# EAGLE design IR-Blue BT2 PCB (EAGLE 6.2)
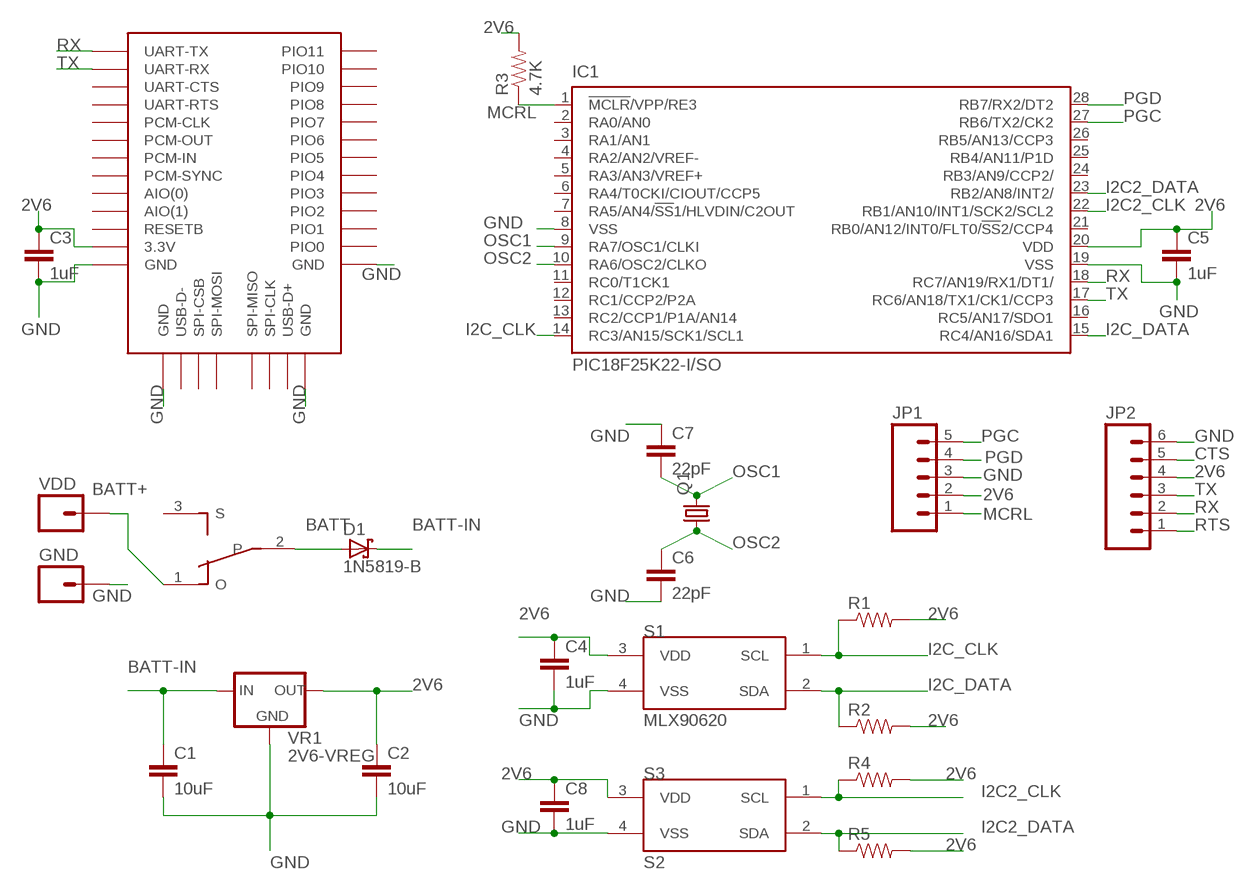
[diagram p0: schematic, sheet 1]

## Parts
C1  10uF  CAPPTH1  [CAP-PTH-5MM]
C2  10uF  CAPPTH1  [CAP-PTH-5MM]
C3  1uF  CAPPTH1  [CAP-PTH-5MM]
C4  1uF  CAPPTH1  [CAP-PTH-5MM]
C5  1uF  CAPPTH1  [CAP-PTH-5MM]
C6  22pF  CAPPTH1  [CAP-PTH-5MM]
C7  22pF  CAPPTH1  [CAP-PTH-5MM]
C8  1uF  CAPPTH1  [CAP-PTH-5MM]
D1  1N5819-B  [DO41-7.6]
GND  M01PTH  [1X01]
IC1  PIC18F25K22-I/SO  [SO28W]
JP1  M05PTH  [1X05]
JP2  M06SIP  [1X06]
Q1  CRYSTALHC49S  [HC49/S]
R1  RESISTORPTH-1/4W  [AXIAL-0.4]
R2  RESISTORPTH-1/4W  [AXIAL-0.4]
R3  4.7K  RESISTORPTH-1/4W  [AXIAL-0.4]
R4  RESISTORPTH-1/4W  [AXIAL-0.4]
R5  RESISTORPTH-1/4W  [AXIAL-0.4]
S1  MLX90620  [TO-39]
S3  S2  MLX90620  [TO-39]
SW1  SMALL_SWITCH  [EG1213]
U$3  BTM400_6B  [BTM400_6B]
VDD  M01PTH  [1X01]
VR1  2V6-VREG  [TO-92]

## Nets
2V6: C2.1 C3.1 C4.1 C5.1 C8.1 IC1.20(VDD) JP1.2 JP2.4 R1.P$2 R2.P$2 R3.P$2 R4.P$2 R5.P$2 S1.3(VDD) S3.3(VDD) U$3.3.3V VR1.1(OUT)
BATT: D1.A SW1.2(P)
BATT+: SW1.1(O) VDD.1
BATT-IN: C1.1 D1.C VR1.3(IN)
CTS: JP2.5
GND [Small 8mil]: C1.2 C2.2 C3.2 C4.2 C5.2 C6.2 C7.1 C8.2 GND.1 IC1.8(VSS) IC1.19(VSS) JP1.3 JP2.6 S1.4(VSS) S3.4(VSS) U$3.GND@1(GND) U$3.GND@2(GND) U$3.GND@3(GND) U$3.GND@4(GND) VR1.2(GND)
I2C2_CLK: IC1.22(RB1/AN10/INT1/SCK2/SCL2) R4.P$1 S3.1(SCL)
I2C2_DATA: IC1.23(RB2/AN8/INT2/) R5.P$1 S3.2(SDA)
I2C_CLK [Small 8mil]: IC1.14(RC3/AN15/SCK1/SCL1) R1.P$1 S1.1(SCL)
I2C_DATA: IC1.15(RC4/AN16/SDA1) R2.P$1 S1.2(SDA)
MCRL: IC1.1(!MCLR!/VPP/RE3) JP1.1 R3.P$1
OSC1 [Medium 10mil]: C7.2 IC1.9(RA7/OSC1/CLKI) Q1.2
OSC2 [Medium 10mil]: C6.1 IC1.10(RA6/OSC2/CLKO) Q1.1
PGC: IC1.27(RB6/TX2/CK2) JP1.5
PGD: IC1.28(RB7/RX2/DT2) JP1.4
RTS: JP2.1
RX: IC1.18(RC7/AN19/RX1/DT1/) JP2.2 U$3.UART-TX
TX: IC1.17(RC6/AN18/TX1/CK1/CCP3) JP2.3 U$3.UART-RX
Unconnected: IC1.2(RA0/AN0) IC1.3(RA1/AN1) IC1.4(RA2/AN2/VREF-) IC1.5(RA3/AN3/VREF+) IC1.6(RA4/T0CKI/CIOUT/CCP5) IC1.7(RA5/AN4/!SS!1/HLVDIN/C2OUT) IC1.11(RC0/T1CK1) IC1.12(RC1/CCP2/P2A) IC1.13(RC2/CCP1/P1A/AN14) IC1.16(RC5/AN17/SDO1) IC1.21(RB0/AN12/INT0/FLT0/!SS!2/CCP4) IC1.24(RB3/AN9/CCP2/) IC1.25(RB4/AN11/P1D) IC1.26(RB5/AN13/CCP3) SW1.3(S) U$3.AIO(0) U$3.AIO(1) U$3.PCM-CLK U$3.PCM-IN U$3.PCM-OUT U$3.PCM-SYNC U$3.PIO(0)(PIO0) U$3.PIO(1)(PIO1) U$3.PIO(2)(PIO2) U$3.PIO(3)(PIO3) U$3.PIO(4)(PIO4) U$3.PIO(5)(PIO5) U$3.PIO(6)(PIO6) U$3.PIO(7)(PIO7) U$3.PIO(8)(PIO8) U$3.PIO(9)(PIO9) U$3.PIO(10)(PIO10) U$3.PIO(11)(PIO11) U$3.RESETB U$3.SPI-CLK U$3.SPI-CSB U$3.SPI-MISO U$3.SPI-MOSI U$3.UART-CTS U$3.UART-RTS U$3.USB-D+ U$3.USB-D-

## Library data of the parts
C1-C8 = SparkFun-Boards:CAP: Capacitor Standard 0603 ceramic capacitor, and 0.1" leaded capacitor.
D1 = diode:1N581*: 1.0A SCHOTTKY BARRIER RECTIFIER Source: http://www.diodes.com/datasheets/ds23001.pdf
GND VDD = SparkFun-Connectors:M01: Header 1 Standard 1-pin 0.1" header. Use with straight break away headers (SKU : PRT-00116), right angle break away headers (PRT-00553), swiss pins (PRT-00743), machine pins (PRT-00117), and female headers (PRT-00115).
IC1 = pic18f25k22:PIC18F25K22: PIC18F25K22 28 pin DIP
JP1 = SparkFun-Connectors:M05: Header 5 Standard 5-pin 0.1" header. Use with straight break away headers (SKU : PRT-00116), right angle break away headers (PRT-00553), swiss pins (PRT-00743), machine pins (PRT-00117), and female headers (PRT-00115). Molex polarized connector foot print use with SKU : PRT-08230 with associated crimp pins and housings.
JP2 = SparkFun-Connectors:M06: Header 6 Standard 6-pin 0.1" header. Use with straight break away headers (SKU : PRT-00116), right angle break away headers (PRT-00553), swiss pins (PRT-00743), machine pins (PRT-00117), and female headers (PRT-00115). Molex polarized connector foot print use with SKU : PRT-08094 with associated crimp pins and housings. NOTES ON THE VARIANTS LOCK and LOCK_LONGPADS... This footprint was designed to help hold the alignment of a through-hole component (i.e. 6-pin header) while soldering it into place. You may notice that each hole has been shifted either up or down by 0.005 of an inch from it's more standard position (which is a perfectly straight line). This slight alteration caused the pins (the squares in the middle) to touch the edges of the holes. Because they are alternating, it causes a "brace" to hold the component in place. 0.005 has proven to be the perfect amount of "off-center" position when using our standard breakaway headers. Although looks a little odd when you look at the bare footprint, once you have a header in there, the alteration is very hard to notice. Also, if you push a header all the way into place, it is covered up entirely on the bottom side. This idea of altering the position of holes to aid alignment will be further integrated into the Sparkfun Library for other footprints. It can help hold any component with 3 or more connection pins.
Q1 = crystal:CRYSTAL: CRYSTAL; OC_FARNELL: 1667008; OC_NEWARK: unknown
R1-R5 = SparkFun-LED:RESISTOR: Resistor Basic schematic elements and footprints for 0603, 1206, and PTH resistors.
S1 S3 = RHWorkshop:MLX90620: The MLX90620 is a fully calibrated 16x4 pixels IR array in an industry standard 4-lead TO-39 package. It contains 2 chips in one package: the Mlx90670 (IR array with signal conditioning electronics) and the 24AA02 (256x8 EEPROM) chip. The MlX90620 contains 64 IR pixels with dedicated low noise chopper stabilized amplifier and fast ADC integrated. A PTAT (Proportional To Absolute Temperature) sensor is integrated to measure the ambient temperature of the chip. The outputs of both IR and PTAT sensors are stored in internal RAM and are accessible through I2C.
SW1 = RHWorkshop:SMALL_SWITCH
U$3 = misc:BTM400_6B
VR1 = RHWorkshop:2V6-VREG

## Net classes
0 default: width 0.406 mm, drill 0.305 mm, clearance 0.305 mm
1 Small 8mil: width 0.203 mm, drill 0.254 mm, clearance 0.203 mm
2 Medium 10mil: width 0.254 mm, drill 0.254 mm, clearance 0.254 mm
3 Large 12mil: width 0.305 mm, drill 0.254 mm, clearance 0.305 mm

## Board
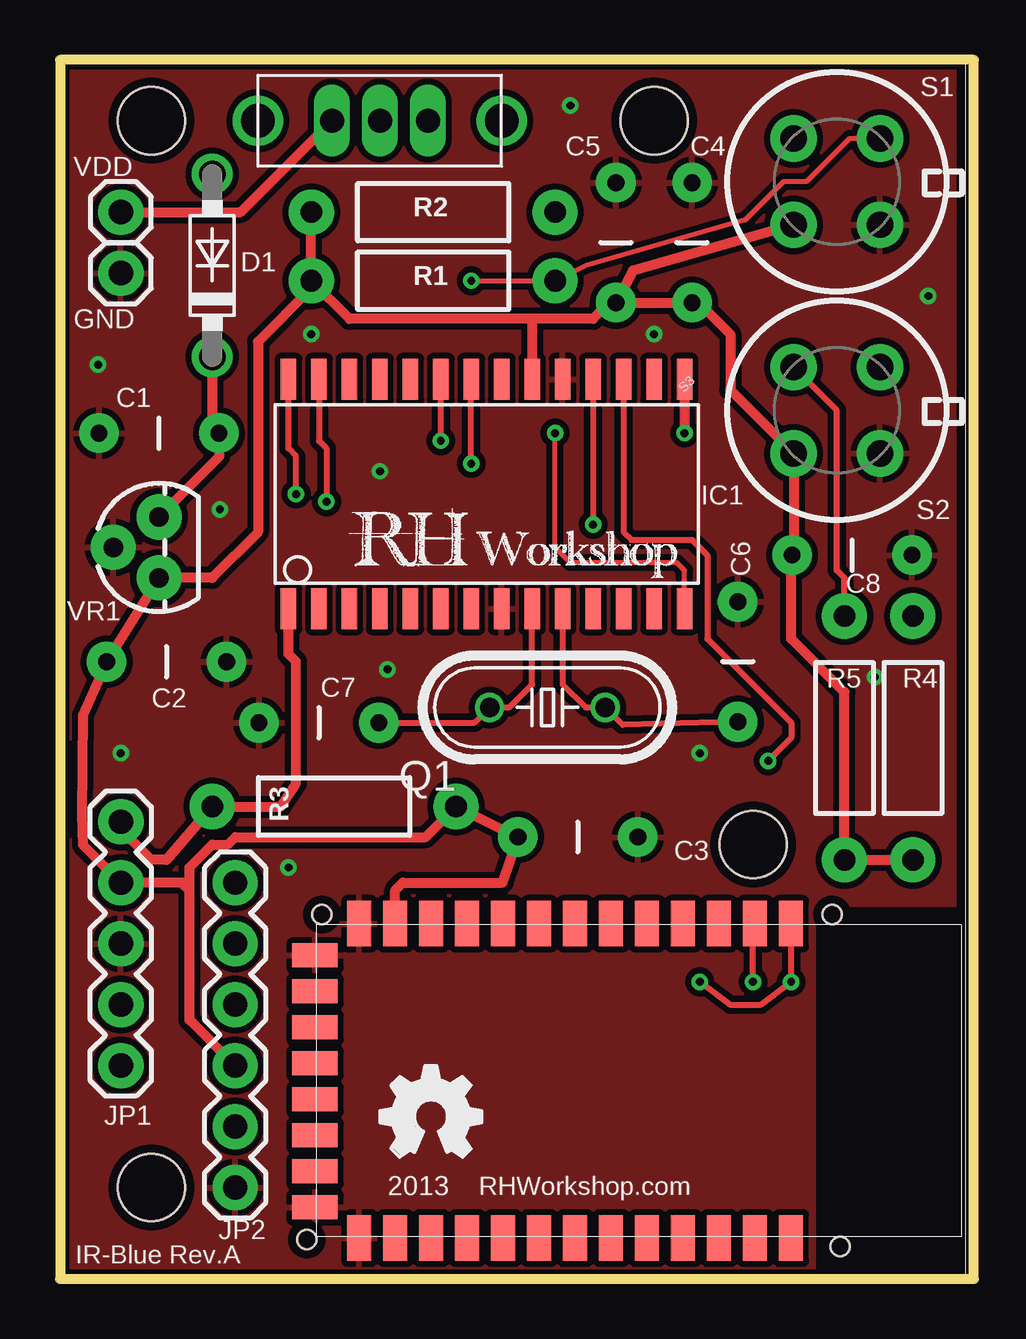
[diagram p1: board, top side]
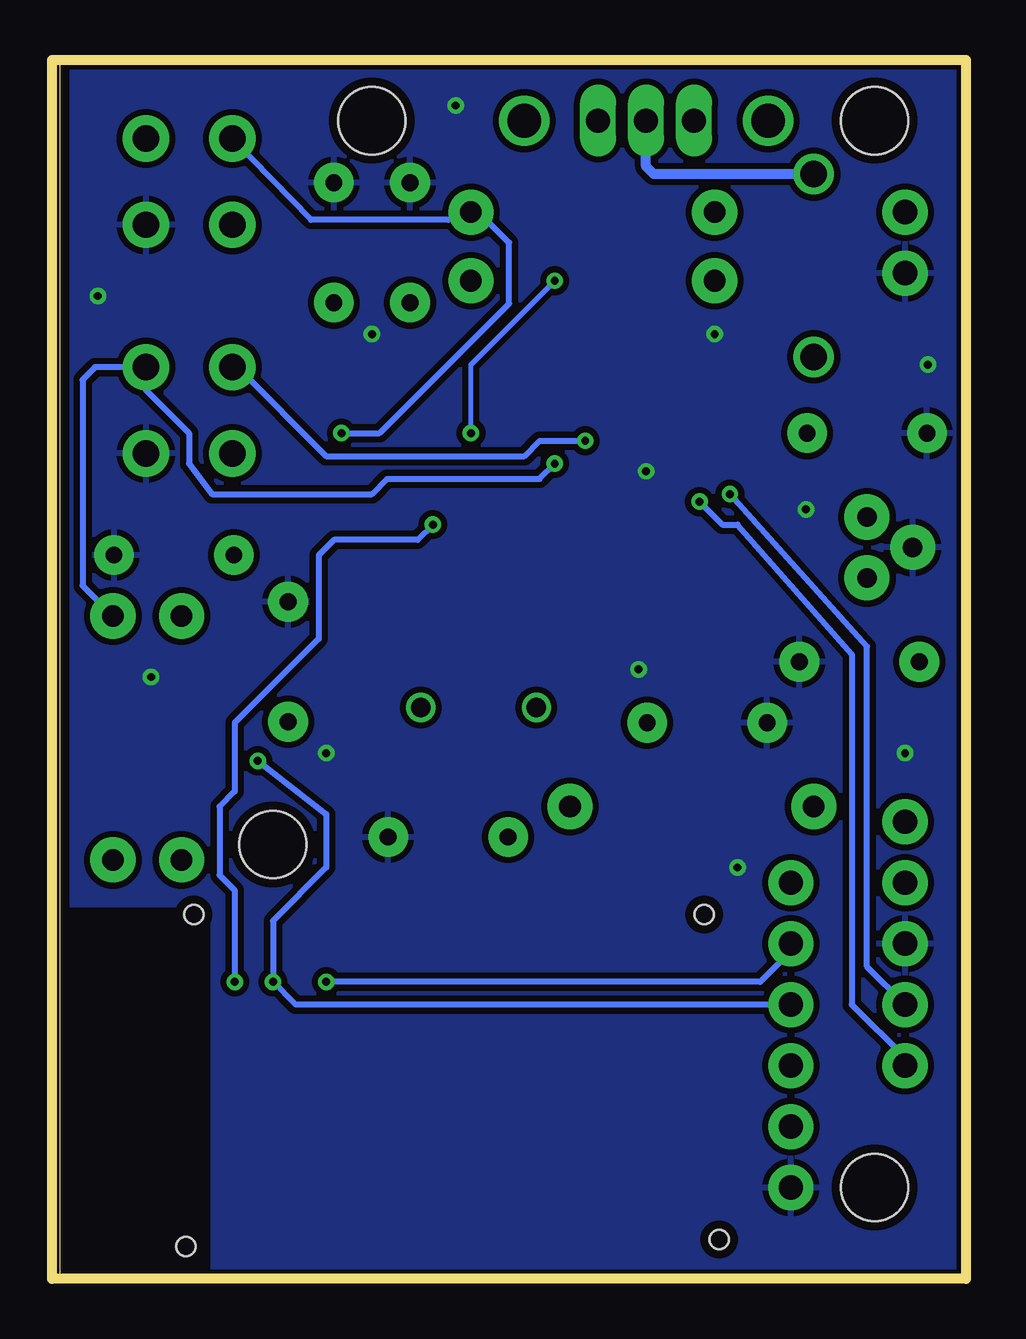
[diagram p2: board, bottom side, seen from below]

Size 37.77 x 50.79 mm. Coordinates in mm from the lower left corner, seen from the top.
Outline: 0,0 37.77,0 37.77,50.79 0,50.79 0,0
Copper layers (1*16): Top 0.0356mm / dielectric 1.5011mm / Bottom 0.0356mm
Design rules: minimum track width 6mil, minimum drill 13mil, track to track 6mil, track to pad 6mil, pad to pad 6mil, via to via 6mil, smd to smd 6mil, copper to edge 15mil, drill to drill 6mil, minimum pad ring 7mil, minimum via ring 7mil, stop-mask expansion 4mil, vias tented up to drill 15mil, thermal gap 10mil
Holes 2.8 mm at 3.81,3.81 28.89,18.1 3.81,48.26 24.77,48.26
Holes 0.8 mm at 10.92,15.19
Holes 0.79 mm at 10.29,1.65 32.51,1.35 32.19,15.19
tRestrict: area 31.7,0 to 38.1,15.2
bRestrict: area 31.7,0 to 38.1,15.2
Milling: 4 lines

### Footprints (pad centres in the part's own frame; a part is rotated, then mirrored left to right if it is on the bottom)
CAP-PTH-5MM = drill 0.7 pad 1.651: 1 -2.5,0; 2 2.5,0
DO41-7.6 = drill 1.1 pad 1.7: A 3.81,0; C -3.81,0
1X01 = drill 1.016 pad 1.88: 1 0,0
SO28W = smd 0.65 x 1.7: 1 -7.62,-4.78; 2 -6.35,-4.78; 3 -5.08,-4.78; 4 -3.81,-4.78; 5 -2.54,-4.78; 6 -1.27,-4.78; 7 0,-4.78; 8 1.27,-4.78; 9 2.54,-4.78; 10 3.81,-4.78; 11 5.08,-4.78; 12 6.35,-4.78; 13 7.62,-4.78; 14 8.89,-4.78; 15 8.89,4.78; 16 7.62,4.78; 17 6.35,4.78; 18 5.08,4.78; 19 3.81,4.78; 20 2.54,4.78; 21 1.27,4.78; 22 0,4.78; 23 -1.27,4.78; 24 -2.54,4.78; 25 -3.81,4.78; 26 -5.08,4.78; 27 -6.35,4.78; 28 -7.62,4.78
1X05 = drill 1.016 pad 1.88: 1 0,0; 2 2.54,0; 3 5.08,0; 4 7.62,0; 5 10.16,0
1X06 = drill 1.016 pad 1.88: 1 0,0; 2 2.54,0; 3 5.08,0; 4 7.62,0; 5 10.16,0; 6 12.7,0
HC49/S = drill 0.813: 1 -2.413,0; 2 2.413,0
AXIAL-0.4 = drill 0.9 pad 1.88: P$1 -5.08,0; P$2 5.08,0
TO-39 = drill 1.1 pad 1.93: 1 2.54,0; 2 0,2.54; 3 -2.54,0; 4 0,-2.54
EG1213 = drill 1 long: 1 -1.999,0; 2 0,0; 3 1.999,0 | drill 1.4: P$1 -5.08,0; P$2 5.08,0
BTM400_6B = smd 1.9 x 1: 3.3V -6.55,-10.16; AIO(0) -6.55,-5.66; AIO(1) -6.55,-7.16; GND@1 -6.55,-11.66; GND@4 6.55,-11.66; PCM-CLK -6.55,0.34; PCM-IN -6.55,-2.66; PCM-OUT -6.55,-1.16; PCM-SYNC -6.55,-4.16; PIO(0) 6.55,-10.16; PIO(1) 6.55,-8.66; PIO(2) 6.55,-7.16; PIO(3) 6.55,-5.66; PIO(4) 6.55,-4.16; PIO(5) 6.55,-2.66; PIO(6) 6.55,-1.16; PIO(7) 6.55,0.34; PIO(8) 6.55,1.84; PIO(9) 6.55,3.34; PIO(10) 6.55,4.84; PIO(11) 6.55,6.34; RESETB -6.55,-8.66; UART-CTS -6.55,3.34; UART-RTS -6.55,1.84; UART-RX -6.55,4.84; UART-TX -6.55,6.34 | smd 1 x 1.9: GND@2 -5.23,-13.5; GND@3 5.27,-13.5; SPI-CLK 2.27,-13.5; SPI-CSB -2.23,-13.5; SPI-MISO 0.77,-13.5; SPI-MOSI -0.73,-13.5; USB-D+ 3.77,-13.5; USB-D- -3.73,-13.5
TO-92 = drill 0.813 pad 1.88: 1 -1.27,0; 2 0,1.905; 3 1.27,0

### Placement (x,y rotation side)
C1  4.13,35.24 180 top
C2  4.45,25.72 0 top
C3  21.59,18.41 0 top
C4  26.35,43.18 90 top
C5  23.18,43.18 90 top
C6  28.26,25.72 90 top
C7  10.79,23.18 0 top
C8  33.02,30.16 0 top
D1  6.35,42.23 90 top
GND  2.54,41.91 0 top
IC1  17.14,32.7 0 top
JP1  2.54,19.05 270 top
JP2  7.3,16.51 270 top
Q1  20.32,23.81 180 top
R1  15.56,41.59 180 top
R2  15.56,44.45 180 top
R3  11.43,19.68 0 top
R4  35.56,22.54 270 top
R5  32.7,22.54 270 top
S1  32.38,45.72 45 top
S3  32.38,36.2 45 top
SW1  13.34,48.26 0 top
U$1  [RH-LOGO]  12.06,29.21 0 top
U$2  [OSHW_FILLX150_NOTEXT]  13.34,5.08 0 top
U$3  24.13,8.26 270 top
VDD  2.54,44.45 0 top
VR1  4.13,30.48 90 top

### Tracks (layer width: path | path; a pad name or v marks a point on that pad's centre or on a via)
2V6
  Top 0.406: R4.P$2 R5.P$2 32.7,24.45 30.48,26.67 30.48,30.12 C8.1 30.59,30.87 S3.3 27.94,37.05 27.94,39.37 26.63,40.68 C4.1 C5.1 | S1.3 23.88,42.02 C5.1 | C5.1 22.9,40.68 22.23,40.01 19.68,40.01 | 19.68,40.01 12.06,40.01 R1.P$2 | R1.P$2 R2.P$2 | R1.P$2 10.48,41.27 8.26,39.05 8.26,31.11 6.35,29.21 VR1.1 C2.1 0.95,23.5 0.91,19.33 0.95,18.1 JP1.2 5.08,16.51 5.4,16.19 | 19.68,40.01 IC1.20 | U$3.3.3V 13.97,16.19 14.29,16.51 18.45,16.51 C3.1 19.05,18.41 R3.P$2 15.24,18.41 7.3,18.41 6.99,18.1 6.35,18.1 5.4,17.14 5.4,16.19 | JP2.4 5.4,10.79 5.4,16.19
BATT
  Bottom 0.406: D1.A 13.02,46.04 13.34,46.35 SW1.2
BATT+
  Top 0.406: VDD.1 7.53,44.45 SW1.1
BATT-IN
  Top 0.406: D1.C 6.35,35.52 C1.1 6.63,34.25 VR1.3
GND  (via drill 0.33)
  other vias: 36.2,40.96 21.27,48.9 1.59,38.1 10.48,39.37 24.77,39.37 13.65,25.4 26.67,21.91 33.97,25.08 9.53,17.14 2.54,21.91 13.34,33.66 6.67,32.07
  pour Top (isolate 0.254, rank 6): 0,50.8 38.1,50.8 38.1,0 0,0
  pour Bottom (isolate 0.254, rank 6): 0,50.8 38.1,50.8 38.1,0 0,0
I2C2_CLK  (via drill 0.33)
  Top 0.254: v17.14,33.97 IC1.22
  Bottom 0.254: R4.P$1 36.83,28.89 36.83,37.47 36.3,37.99 S3.1 34.18,37.04 32.38,35.24 32.38,33.97 31.43,32.7 24.77,32.7 24.13,33.34 17.78,33.34 v17.14,33.97
I2C2_DATA  (via drill 0.33)
  Top 0.254: R5.P$1 32.7,29.21 32.38,29.53 32.38,36.2 S3.2 | v15.88,34.92 IC1.23
  Bottom 0.254: S3.2 30.37,37.99 26.67,34.29 18.41,34.29 17.78,34.92 v15.88,34.92
I2C_CLK  (via drill 0.33)
  Top 0.203: IC1.14 26.04,29.53 25.72,29.84 21.27,29.84 20.64,30.48 v20.64,35.24 | v17.14,41.59 R1.P$1 21.91,42.23 28.57,44.13 30.16,45.72 31.11,45.72 32.91,47.52 S1.1
  Bottom 0.203: v20.64,35.24 20.64,38.1 v17.14,41.59
I2C_DATA  (via drill 0.33)
  Top 0.406: IC1.15 v26.04,35.24
  Bottom 0.254: v26.04,35.24 24.45,35.24 19.05,40.64 19.05,43.18 20.32,44.45 R2.P$1 21.59,44.13 27.3,44.13 S1.2
MCRL
  Top 0.406: IC1.1 9.53,26.04 9.84,25.72 9.84,20.64 9.21,19.68 R3.P$1 4.45,17.46 3.81,17.46 2.54,18.73 JP1.1
OSC1
  Top 0.254: C7.2 17.27,23.18 Q1.2 18.73,23.81 19.68,24.77 IC1.9
OSC2
  Top 0.254: C6.1 23.45,23.09 Q1.1 21.91,23.81 20.95,24.77 IC1.10
PGC  (via drill 0.33)
  Top 0.254: IC1.27 10.79,34.92 11.11,34.61 v11.11,32.38
  Bottom 0.254: v11.11,32.38 10.16,31.43 9.53,31.43 4.76,26.04 4.76,11.43 2.54,9.21 JP1.5
PGD  (via drill 0.33)
  Top 0.254: v9.84,32.7 9.84,34.29 9.53,34.61 IC1.28
  Bottom 0.254: JP1.4 4.13,13.02 4.13,26.35 v9.84,32.7
RX  (via drill 0.33)
  Top 0.254: v26.67,12.38 27.94,11.43 29.21,11.43 v30.48,12.38 U$3.UART-TX | IC1.18 v22.23,31.43
  Bottom 0.254: JP2.2 7.3,13.65 8.57,12.38 v26.67,12.38 | v22.23,31.43 22.86,30.8 26.35,30.8 26.99,30.16 26.99,26.67 30.48,23.18 30.48,20.32 31.11,19.68 31.11,16.83 30.48,16.19 v30.48,12.38
TX  (via drill 0.33)
  Top 0.254: v28.89,12.38 28.89,14.73 U$3.UART-RX | IC1.17 23.5,31.11 23.81,30.8 26.35,30.8 26.99,30.16 26.99,26.67 30.48,23.18 30.48,22.54 v29.53,21.59
  Bottom 0.254: JP2.3 27.94,11.43 v28.89,12.38 28.89,14.92 26.67,17.14 26.67,19.37 v29.53,21.59

### Text on the board
_tsilk: 2013 | RHWorkshop.com | IR-Blue Rev.A